# EAGLE design untitled (EAGLE 8.7.0)
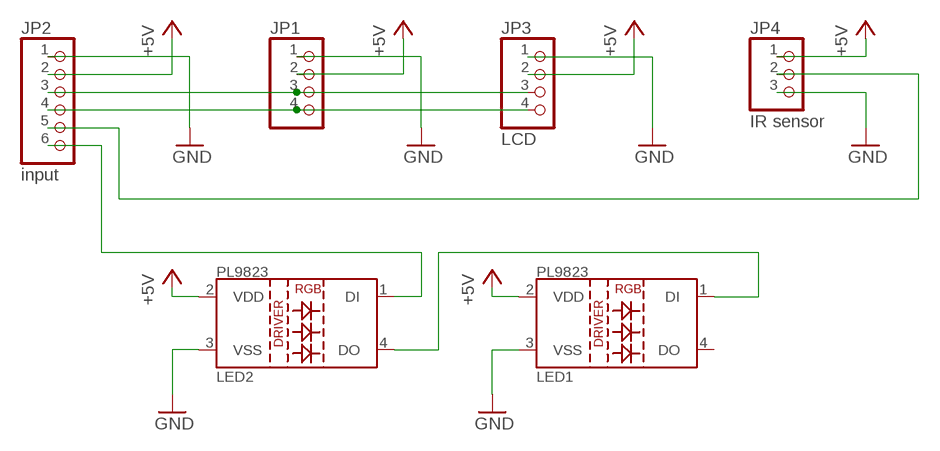
[diagram p0: schematic, sheet 1]

## Parts
JP1  PINHD-1X4  [1X04]
JP2  input  PINHD-1X6  [1X06]
JP3  LCD  PINHD-1X4  [1X04]
JP4  IR sensor  PINHD-1X3  [1X03]
LED1  LED-PL9823-F5  [LED-PL9823-F5]
LED2  LED-PL9823-F5  [LED-PL9823-F5]

## Nets
+5V [power]: JP1.2 JP2.2 JP3.2 JP4.1 LED1.2(VDD) LED2.2(VDD)
GND [power]: JP1.1 JP2.1 JP3.1 JP4.3 LED1.3(VSS) LED2.3(VSS)
N$1: JP1.3 JP2.3 JP3.3
N$2: JP2.5 JP4.2
N$3: JP1.4 JP2.4 JP3.4
N$5: JP2.6 LED2.1(DI)
N$6: LED1.1(DI) LED2.4(DO)
Unconnected: LED1.4(DO)

## Library data of the parts
JP1 JP3 = pinhead:PINHD-1X4: PIN HEADER
JP2 = pinhead:PINHD-1X6: PIN HEADER
JP4 = pinhead:PINHD-1X3: PIN HEADER
LED1 LED2 = Ai_LED:LED-PL9823

## Net classes
0 default: width 0.508 mm, clearance 0.254 mm
1 power: width 1.016 mm, clearance 0.254 mm

## Board
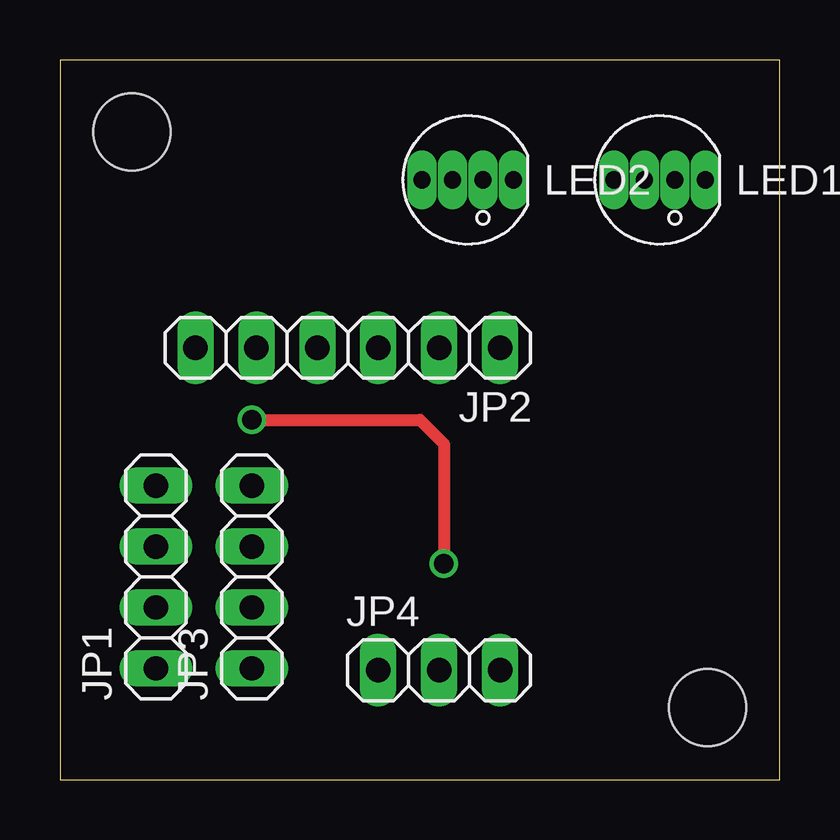
[diagram p1: board, top side]
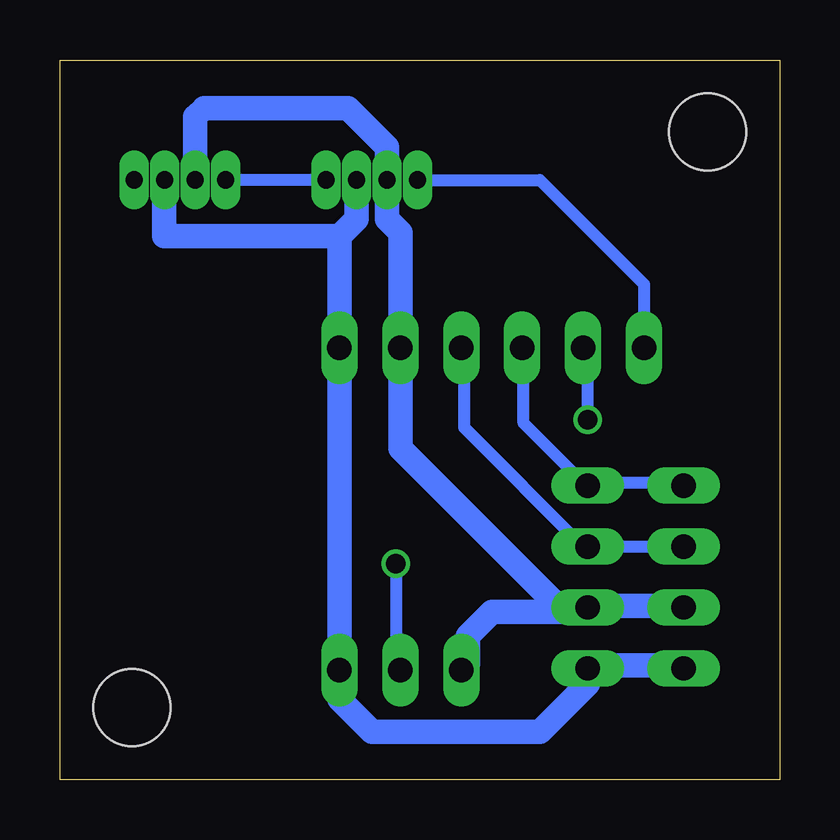
[diagram p2: board, bottom side, seen from below]

Size 30 x 30 mm. Coordinates in mm from the lower left corner, seen from the top.
Outline: 0,0 30,0 30,30 0,30 0,0
Copper layers (1*16): Top 0.035mm / dielectric 1.5mm / Bottom 0.035mm
Design rules "Mits_Eleven_Auto": minimum track width 0.25mm, minimum drill 0.6mm, track to track 0.2mm, track to pad 0.2mm, pad to pad 0.2mm, via to via 0.2mm, smd to smd 0.2mm, copper to edge 1mm, drill to drill 0.2mm, minimum pad ring 10mil, minimum via ring 8mil, stop-mask expansion 4mil, vias tented up to drill 0mil, thermal gap 0.25mm
Holes 3.2 mm at 3,27 27,3

### Footprints (pad centres in the part's own frame; a part is rotated, then mirrored left to right if it is on the bottom)
1X04 = drill 1.016 long: 1 -3.81,0; 2 -1.27,0; 3 1.27,0; 4 3.81,0
1X06 = drill 1.016 long: 1 -6.35,0; 2 -3.81,0; 3 -1.27,0; 4 1.27,0; 5 3.81,0; 6 6.35,0
1X03 = drill 1.016 long: 1 -2.54,0; 2 0,0; 3 2.54,0
LED-PL9823-F5 = drill 0.711 pad 0.889 long: 1 -1.905,0; 2 -0.635,0; 3 0.635,0; 4 1.905,0

### Placement (x,y rotation side)
JP1  4,8.45 90 top
JP2  12,18 180 top
JP3  8,8.45 90 top
JP4  15.81,4.56 0 top
LED1  25,25 0 top
LED2  17,25 0 top

### Tracks (layer width: path | path; a pad name or v marks a point on that pad's centre or on a via)
+5V
  Bottom 1.016: 8,7.05 JP3.2 | JP1.2 4,7.24 7.62,7.24 JP3.2 | JP3.2 8.18,7 9,7 | 9,7 12,7 13,6 13,4.83 JP4.1 | 9,7 15.81,13.81 JP2.2 15.81,22.81 16.36,23.36 LED2.2 16.36,26.36 18,28 24,28 24.36,27.64 LED1.2
GND
  Bottom 1.016: JP1.1 4,4.76 7.81,4.76 JP3.1 8,4 10,2 17,2 18.35,3.35 JP4.3 JP2.1 18.35,22.65 | 18.35,22.65 25.65,22.65 25.65,24.98 LED1.3 | LED2.3 17.64,23.36 18.35,22.65
N$1
  Bottom 0.508: JP1.3 7.81,9.72 JP3.3 8.19,9.72 13.14,14.67 13.14,17.91 JP2.3 | JP1.3
N$2  (via drill 0.8)
  Top 0.508: v8,15 15,15 16,14 v16,9
  Bottom 0.508: v16,9 16,4.75 JP4.2 | v8,15 8,17.81 JP2.5
N$3
  Bottom 0.508: JP1.4 4,12.38 7.81,12.38 JP3.4 8.19,12.38 10.67,14.86 10.67,17.91 JP2.4
N$5
  Bottom 0.508: LED2.1 10,25 5.65,20.65 JP2.6
N$6
  Bottom 0.508: LED2.4 LED1.1